# EAGLE design Gameboy Pocket (EAGLE 8.0.0)
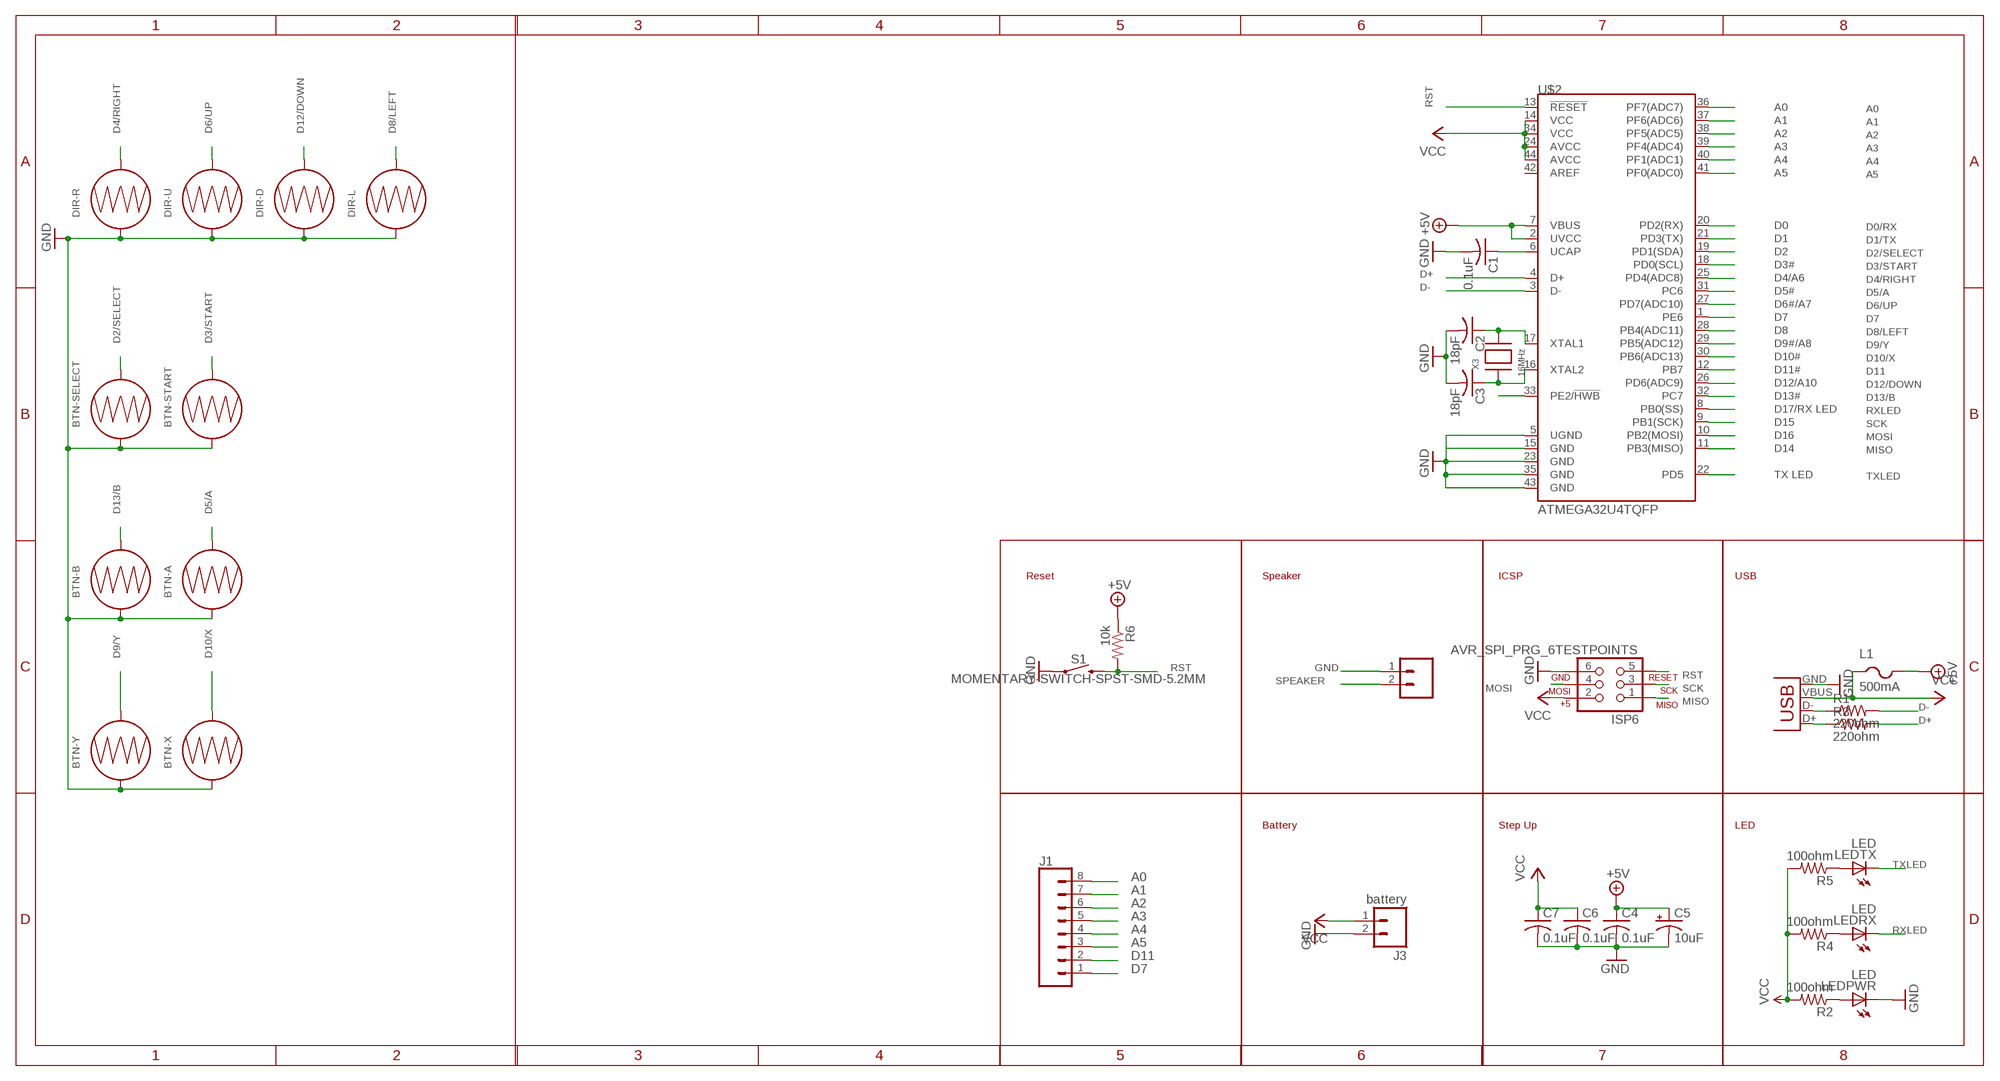
[diagram p0: schematic, sheet 1]

## Parts
BTN-A  BUTTON-CONDUCTIVESMD  [BUTTON-CONDUCTIVE]
BTN-B  BUTTON-CONDUCTIVESMD  [BUTTON-CONDUCTIVE]
BTN-SELECT  BUTTON-CONDUCTIVESMD  [BUTTON-CONDUCTIVE]
BTN-START  BUTTON-CONDUCTIVESMD  [BUTTON-CONDUCTIVE]
BTN-X  BUTTON-CONDUCTIVESMD  [BUTTON-CONDUCTIVE]
BTN-Y  BUTTON-CONDUCTIVESMD  [BUTTON-CONDUCTIVE]
C1  0.1uF  C-USC0805  [C0805]
C2  18pF  C-USC0805  [C0805]
C3  18pF  C-USC0805  [C0805]
C4  0.1uF  C-USC0805  [C0805]
C5  10uF  10UF-TANT  [EIA3216]
C6  0.1uF  C-USC0805  [C0805]
C7  0.1uF  C-USC0805  [C0805]
CN1  USB-SMD-NS  [USB-MINIB-NOSTOP]
DIR-D  BUTTON-CONDUCTIVESMD  [BUTTON-CONDUCTIVE]
DIR-L  BUTTON-CONDUCTIVESMD  [BUTTON-CONDUCTIVE]
DIR-R  BUTTON-CONDUCTIVESMD  [BUTTON-CONDUCTIVE]
DIR-U  BUTTON-CONDUCTIVESMD  [BUTTON-CONDUCTIVE]
ISP6  AVR_SPI_PRG_6TESTPOINTS  [2X3_TEST_POINTS]
J1  CONN_08NO_SILK_FEMALE_PTH  [1X08_NO_SILK]
J3  battery  M02JST-PTH-VERT  [JST-2-PTH-VERT]
JP2  M02PTH  [1X02]
L1  500mA  PTCFUSE-1206  [R1206]
LEDPWR  LED  LEDCHIPLED_0805  [CHIPLED_0805]
LEDRX  LED  LEDCHIPLED_0805  [CHIPLED_0805]
LEDTX  LED  LEDCHIPLED_0805  [CHIPLED_0805]
R1  220ohm  R-US_R0805  [R0805]
R2  100ohm  R-US_R0805  [R0805]
R3  220ohm  R-US_R0805  [R0805]
R4  100ohm  R-US_R0805  [R0805]
R5  100ohm  R-US_R0805  [R0805]
R6  10k  R-US_R0805  [R0805]
S1  MOMENTARY-SWITCH-SPST-SMD-5.2MM  [TACTILE_SWITCH_SMD_5.2MM]
U$2  ATMEGA32U4TQFP  [SPARKFUN-DIGITALIC_TQFP44]
X3  16MHz  XTALNX5032  [NX5032]

## Nets
+5V: C4.1 C5.A(+) L1.2 R6.1 U$2.2(UVCC) U$2.7(VBUS)
A0: J1.8 U$2.36(PF7(ADC7))
A1: J1.7 U$2.37(PF6(ADC6))
A2: J1.6 U$2.38(PF5(ADC5))
A3: J1.5 U$2.39(PF4(ADC4))
A4: J1.4 U$2.40(PF1(ADC1))
A5: J1.3 U$2.41(PF0(ADC0))
D0/RX: U$2.20(PD2(RX))
D1/TX: U$2.21(PD3(TX))
D2/SELECT: BTN-SELECT.2 U$2.19(PD1(SDA))
D3/START: BTN-START.2 U$2.18(PD0(SCL))
D4/RIGHT: DIR-R.2 U$2.25(PD4(ADC8))
D5/A: BTN-A.2 U$2.31(PC6)
D6/UP: DIR-U.2 U$2.27(PD7(ADC10))
D7: J1.1 U$2.1(PE6)
D8/LEFT: DIR-L.2 U$2.28(PB4(ADC11))
D9/Y: BTN-Y.2 U$2.29(PB5(ADC12))
D10/X: BTN-X.2 U$2.30(PB6(ADC13))
D11: J1.2 U$2.12(PB7)
D12/DOWN: DIR-D.2 U$2.26(PD6(ADC9))
D13/B: BTN-B.2 U$2.32(PC7)
D+: R3.2 U$2.4(D+)
D-: R1.2 U$2.3(D-)
GND: BTN-A.1 BTN-B.1 BTN-SELECT.1 BTN-START.1 BTN-X.1 BTN-Y.1 C1.2 C2.2 C3.2 C4.2 C5.C(-) C6.2 C7.2 CN1.GND DIR-D.1 DIR-L.1 DIR-R.1 DIR-U.1 ISP6.6 J3.2 JP2.1 LEDPWR.C S1.1 U$2.5(UGND) U$2.15(GND) U$2.23(GND) U$2.35(GND) U$2.43(GND)
HWB: U$2.33(PE2/!HWB)
MISO: ISP6.1 U$2.11(PB3(MISO))
MOSI: ISP6.4 U$2.10(PB2(MOSI))
N$2: LEDPWR.A R2.1
N$3: CN1.D+ R3.1
N$5: CN1.D- R1.1
N$6: LEDRX.A R4.1
N$7: LEDTX.A R5.1
N$8: C2.1 U$2.17(XTAL1) X3.P$2
N$9: C3.1 U$2.16(XTAL2) X3.P$1
RST: ISP6.5 R6.2 S1.3 U$2.13(!RESET)
RXLED: LEDRX.C U$2.8(PB0(SS))
SCK: ISP6.3 U$2.9(PB1(SCK))
SPEAKER: JP2.2
TXLED: LEDTX.C U$2.22(PD5)
UCAP: C1.1 U$2.6(UCAP)
VCC: C6.1 C7.1 CN1.VBUS ISP6.2 J3.1 L1.1 R2.2 R4.2 R5.2 U$2.14(VCC) U$2.24(AVCC) U$2.34(VCC) U$2.44(AVCC)
Unconnected: U$2.42(AREF)

## Notes on the sheet
- Reset | Speaker | ICSP | USB
- Battery | Step Up | LED

## Library data of the parts
BTN-A BTN-B BTN-SELECT BTN-START BTN-X BTN-Y DIR-D DIR-L DIR-R DIR-U = SparkFun-Electromechanical:BUTTON-CONDUCTIVE: Used with rubber key pads. This one was designed and proven to work with the PolyCase Key FOB enclosures.
C1-C4 C6 C7 = adafruit:C-US: CAPACITOR, American symbol
C5 = SparkFun-Retired:10UF-TANT: 10uF Tantalum SMT CAP-00811- 16V 10% (EIA-3216); PROD_ID: CAP-00811
CN1 = SparkFun-Connectors:USB: USB Connectors USB-B-PTH is fully proven SKU : PRT-00139/CONN-08278 USB-miniB is fully proven SKU : PRT-00587 USB-A-PCB is untested. USB-A-H is throughly reviewed, but untested. Spark Fun Electronics SKU : PRT-00437 USB-B-SMT is throughly reviewed, but untested. Needs silkscreen touching up. USB-A-S has not been used/tested USB-MB-H has not been used/tested USB-MICROB has been used. CONN-09505
ISP6 = SparkFun-Connectors:AVR_SPI_PRG_6: AVR ISP 6 Pin This is the reduced ISP connector for AVR programming. Common on Arduino. This footprint will take up less PCB space and can be used with a 10-pin to 6-pin adapter such as SKU: BOB-08508 **Special note about "TEST_POINT" package. The stop mask is on the top side, so if you want your programming test points to be on the bottom of your board, make sure to place this package on the bottom side of the board. This also ensure that the orientation to program from the bottom side will be correct.
J1 = SparkFun-Connectors:CONN_08: Multi connection point. Often used as Generic Header-pin footprint for 0.1 inch spaced/style header connections On any of the 0.1 inch spaced packages, you can populate with these: Break Away Headers - Straight <https://www.sparkfun.com/products/116> (PRT-00116) Break Away Male Headers - Right Angle <https://www.sparkfun.com/products/553> (PRT-00553) Female Headers <https://www.sparkfun.com/products/115> (PRT-00115) Break Away Headers - Machine Pin <https://www.sparkfun.com/products/117> (PRT-00117) Break Away Female Headers - Swiss Machine Pin <https://www.sparkfun.com/products/743> (PRT-00743) Arduino Stackable Header - 8 Pin <https://www.sparkfun.com/products/9279> (PRT-09279) For SCREWTERMINALS and SPRING TERMINALS visit here: Screw Terimnals on SparkFun.com <https://www.sparkfun.com/search/results?term=Screw+Terminals> (5mm/3.5mm/2.54mm spacing) This device is also useful as a general connection point to wire up your design to another part of your project. Our various solder wires solder well into these plated through hole pads. Hook-Up Wire - Assortment (Stranded, 22 AWG) <https://www.sparkfun.com/products/11375> (PRT-11375) Hook-Up Wire - Assortment (Solid Core, 22 AWG) <https://www.sparkfun.com/products/11367> (PRT-11367) View the entire wire category on our website here <https://www.sparkfun.com/categories/141> Special notes: Molex polarized connector foot print use with SKU : PRT-08231 with associated crimp pins and housings. 1MM SMD Version SKU: PRT-10208 NOTES ON THE VARIANTS LOCK and LOCK_LONGPADS... This footprint was designed to help hold the alignment of a through-hole component (i.e. 6-pin header) while soldering it into place. You may notice that each hole has been shifted either up or down by 0.005 of an inch from it's more standard position (which is a perfectly straight line). This slight alteration caused the pins (the squares in the middle) to touch the edges of the holes. Because they are alternating, it causes a "brace" to hold the component in place. 0.005 has proven to be the perfect amount of "off-center" position when using our standard breakaway headers. Although looks a little odd when you look at the bare footprint, once you have a header in there, the alteration is very hard to notice. Also,if you push a header all the way into place, it is covered up entirely on the bottom side.; PROD_ID: CONN-08438
J3 JP2 = SparkFun-Connectors:M02: Standard 2-pin 0.1" header. Use with - straight break away headers ( PRT-00116) - right angle break away headers (PRT-00553) - swiss pins (PRT-00743) - machine pins (PRT-00117) - female headers (PRT-00115) Molex polarized connector foot print use with: PRT-08233 with associated crimp pins and housings. 2.54_SCREWTERM for use with PRT-10571. 3.5mm Screw Terminal footprints for PRT-08084 5mm Screw Terminal footprints for use with PRT-08432
L1 = adafruit:PTCFUSE: PTC fuses, resettable thermistors
LEDPWR LEDRX LEDTX = adafruit:LED: LED OSRAM: - CHIPLED LG R971, LG N971, LY N971, LG Q971, LY Q971, LO R971, LY R971 LH N974, LH R974 LS Q976, LO Q976, LY Q976 LO Q996 - Hyper CHIPLED LW Q18S LB Q993, LB Q99A, LB R99A - SideLED LS A670, LO A670, LY A670, LG A670, LP A670 LB A673, LV A673, LT A673, LW A673 LH A674 LY A675 LS A676, LA A676, LO A676, LY A676, LW A676 LS A679, LY A679, LG A679 - Hyper Micro SIDELED® LS Y876, LA Y876, LO Y876, LY Y876 LT Y87S - SmartLED LW L88C, LW L88S LB L89C, LB L89S, LG L890 LS L89K, LO L89K, LY L89K LS L896, LA L896, LO L896, LY L896 - TOPLED LS T670, LO T670, LY T670, LG T670, LP T670 LSG T670, LSP T670, LSY T670, LOP T670, LYG T670 LG T671, LOG T671, LSG T671 LB T673, LV T673, LT T673, LW T673 LH T674 LS T676, LA T676, LO T676, LY T676, LB T676, LH T676, LSB T676, LW T676 LB T67C, LV T67C, LT T67C, LS T67K, LO T67K, LY T67K, LW E67C LS E67B, LA E67B, LO E67B, LY E67B, LB E67C, LV E67C, LT E67C LW T67C LS T679, LY T679, LG T679 LS T770, LO T770, LY T770, LG T770, LP T770 LB T773, LV T773, LT T773, LW T773 LH T774 LS E675, LA E675, LY E675, LS T675 LS T776, LA T776, LO T776, LY T776, LB T776 LHGB T686 LT T68C, LB T68C - Hyper Mini TOPLED® LB M676 - Mini TOPLED Santana® LG M470 LS M47K, LO M47K, LY M47K Source: http://www.osram.convergy.de/
R1-R6 = adafruit:R-US_: RESISTOR, American symbol
S1 = SparkFun-Switches:MOMENTARY-SWITCH-SPST: Momentary Switch (Pushbutton) - SPST Normally-open (NO) SPST momentary switches (buttons, pushbuttons). Variants PTH-12MM - 12mm square, through-hole Momentary Pushbutton Switch - 12mm Square <https://www.sparkfun.com/products/9190> (COM-09190) PTH-6.0MM, PTH-6.0MM-KIT - 6.0mm square, through-hole Mini Pushbutton Switch <https://www.sparkfun.com/products/97> (COM-00097) KIT package intended for soldering kit's - only one side of pads' copper is exposed. PTH-RIGHT-ANGLE-KIT - Right-angle, through-hole Right Angle Tactile Button <https://www.sparkfun.com/products/10791> - Used on SparkFun BigTime Watch Kit <https://www.sparkfun.com/products/11734> SMD-12MM - 12mm square, surface-mount Tactile Button - SMD (12mm) <https://www.sparkfun.com/products/12993> (COM-12993) Used on SparkFun PicoBoard <https://www.sparkfun.com/products/11888> SMD-4.5MM - 4.5mm Square Trackball Switch Used on SparkFun Blackberry Trackballer Breakout <https://www.sparkfun.com/products/13169> SMD-4.6MMX2.8MM - 4.60mm x 2.80mm, surface mount Used on SparkFun SAMD21 Mini Breakout <https://www.sparkfun.com/products/13664> SMD-5.2MM, SMD-5.2-REDUNDANT - 5.2mm square, surface-mount Mini Pushbutton Switch - SMD <https://www.sparkfun.com/products/8720> (COM-08720) Used on Arduino Pro Mini <https://www.sparkfun.com/products/11114> REDUNDANT package connects both switch circuits together SMD-6.0X3.5MM - 6.0 x 3.5mm, surface mount Momentary Reset Switch SMD <https://www.sparkfun.com/products/8229> (COM-08229) SMD-6.2MM-TALL - 6.2mm square, surface mount Tactile Button - SMD (6mm) <https://www.sparkfun.com/products/12992> Used on SparkFun Digital Sandbox <https://www.sparkfun.com/products/12651> SMD-RIGHT-ANGLE - Right-angle, surface mount Used on SparkFun Block for Intel® Edison - Arduino <https://www.sparkfun.com/products/13036>; PROD_ID: SWCH-08247; SF_SKU: COM-08720
U$2 = SparkFun-Retired:ATMEGA32U4: Atmel 44-pin 8-bit Microcontroller with 32KBytes of ISP Flash and USB Controller ----- Please use the QFN-44-NOPAD_1:1 package for the footprint of all boards using a 32U4. Route traces directly away from the pads as much as possible.; PROD_ID: IC-11161
X3 = adaprog:XTAL

## Board
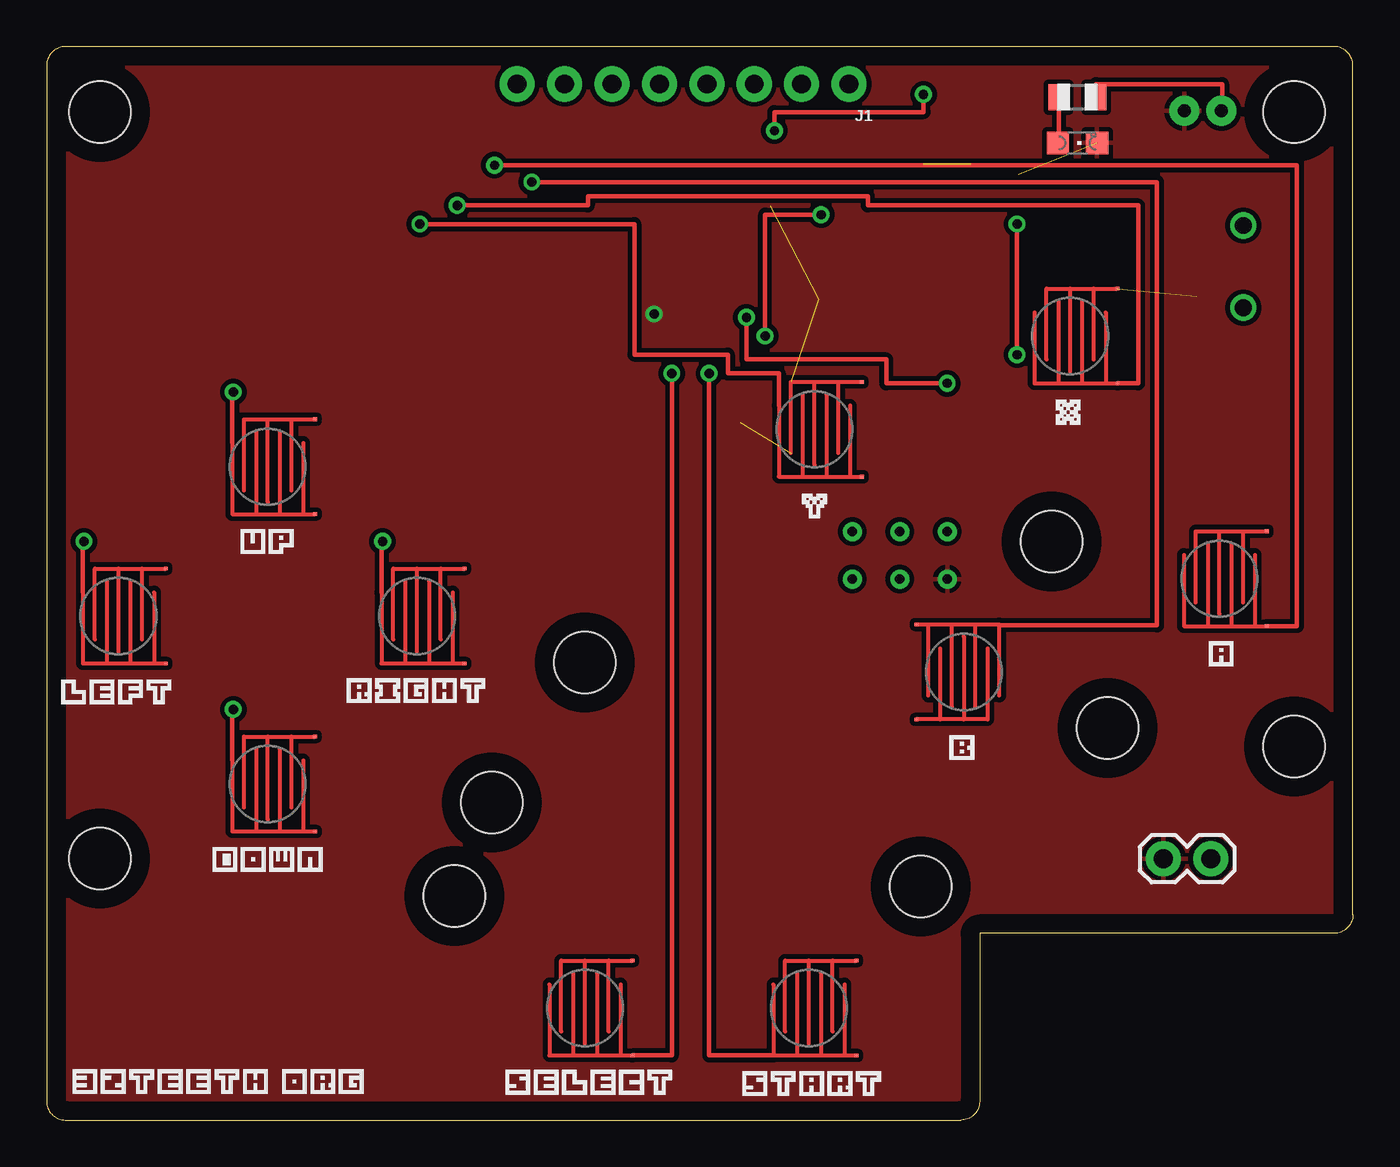
[diagram p1: board, top side]
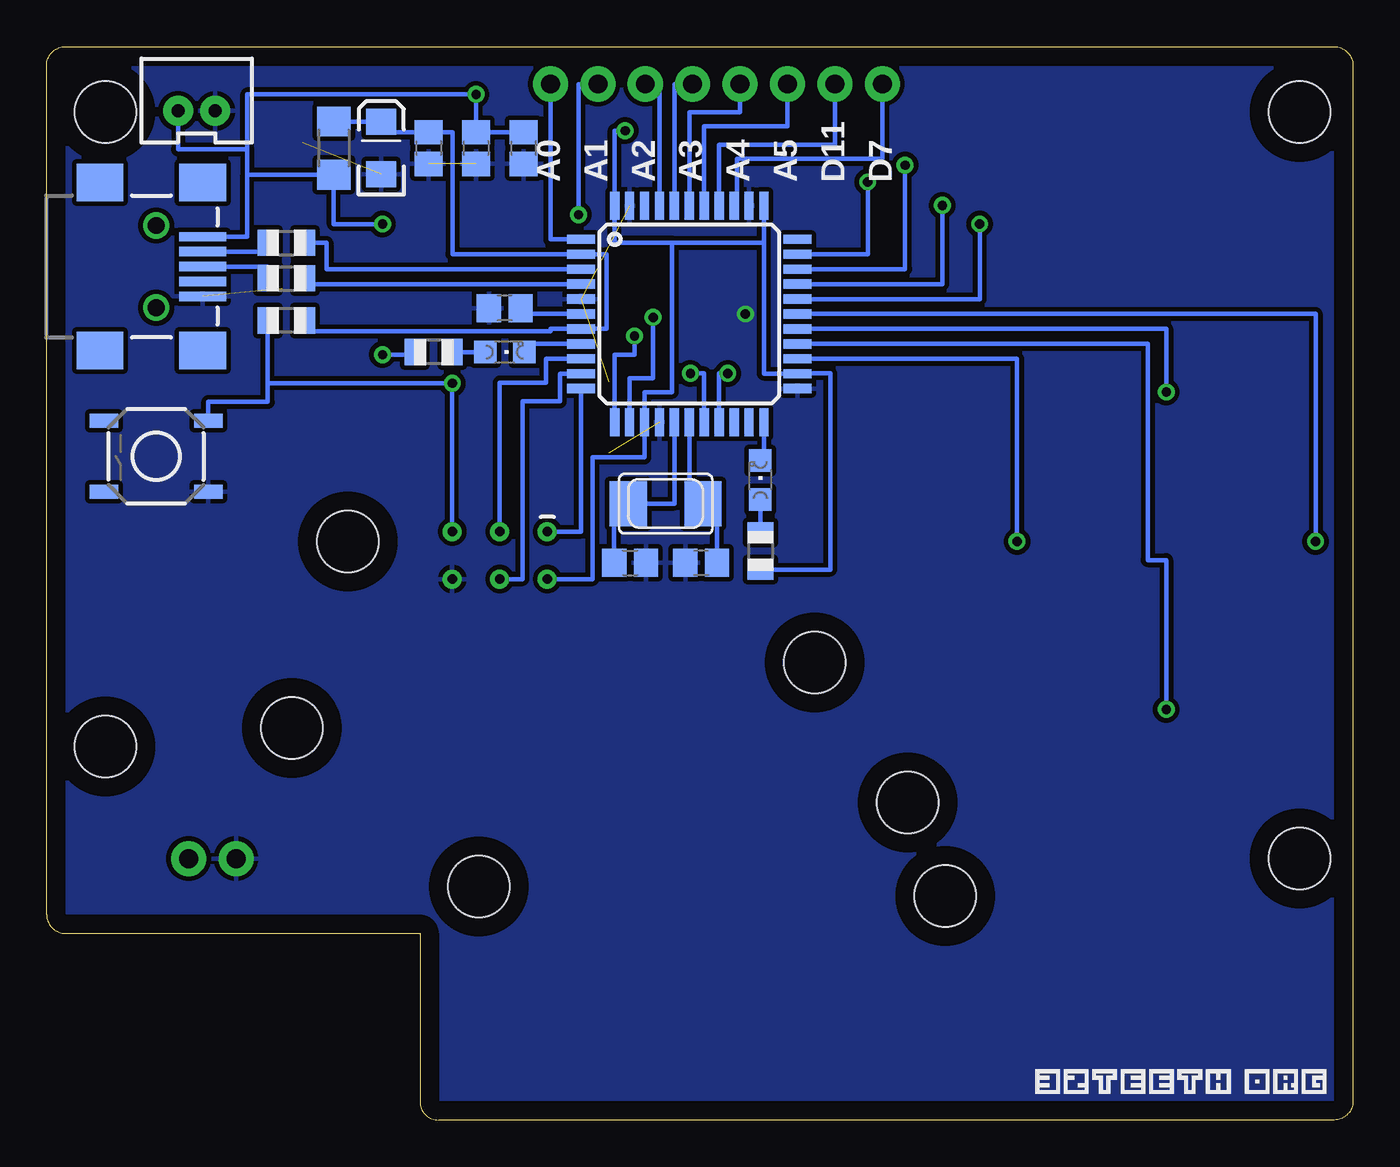
[diagram p2: board, bottom side, seen from below]

Size 70 x 57.5 mm. Coordinates in mm from the lower left corner, seen from the top.
Outline: 70,11 70,56.5 arc90 69,57.5 1,57.5 arc90 0,56.5 0,1 arc90 1,0 49,0 arc90 50,1 50,10 69,10 arc90 70,11
Copper layers (1*16): Top 0.035mm / dielectric 1.5mm / Bottom 0.035mm
Design rules "default *": minimum track width 10mil, minimum drill 20mil, track to track 10mil, track to pad 10mil, pad to pad 10mil, via to via 10mil, smd to smd 10mil, copper to edge 40mil, drill to drill 20mil, minimum pad ring 10mil, minimum via ring 8mil, stop-mask expansion 4mil, vias tented up to drill 20mil, thermal gap 10mil

### Footprints (pad centres in the part's own frame; a part is rotated, then mirrored left to right if it is on the bottom)
BUTTON-CONDUCTIVE = smd 0.203 x 0.203: 1 2.54,2.54; 2 2.54,-2.54
C0805 = smd 1.3 x 1.5: 1 -0.85,0; 2 0.85,0
EIA3216 = smd 1.4 x 1.6: A 1.4,0; C -1.4,0
USB-MINIB-NOSTOP = smd 2.5 x 0.5: D+ 2.5,0; D- 2.5,0.8; GND 2.5,-1.6; ID 2.5,-0.8; VBUS 2.5,1.6 | smd 2.5 x 2: G1 -3,-4.5; G2 -3,4.5; G3 2.5,4.5; G4 2.5,-4.5 | drill 0.9 pad 0.8: H1 0,2.2 | drill 0.9 pad 0.787: H2 0,-2.2
2X3_TEST_POINTS = drill 0.508: 1 -2.54,-1.27; 2 -2.54,1.27; 3 0,-1.27; 4 0,1.27; 5 2.54,-1.27; 6 2.54,1.27
1X08_NO_SILK = drill 1.016 pad 1.88: 1 0,0; 2 2.54,0; 3 5.08,0; 4 7.62,0; 5 10.16,0; 6 12.7,0; 7 15.24,0; 8 17.78,0
JST-2-PTH-VERT = drill 0.7 pad 1.6: 1 -1,-0.55; 2 1,-0.55
1X02 = drill 1.016 pad 1.88: 1 0,0; 2 2.54,0
R1206 = smd 1.6 x 1.803: 1 -1.422,0; 2 1.422,0
CHIPLED_0805 = smd 1.2 x 1.2: A 0,-1.05; C 0,1.05
R0805 = smd 1.1 x 1.4: 1 -1,0; 2 1,0
TACTILE_SWITCH_SMD_5.2MM = smd 1.524 x 0.762: 1 -2.794,1.905; 2 2.794,1.905; 3 -2.794,-1.905; 4 2.794,-1.905
SPARKFUN-DIGITALIC_TQFP44 = smd 1.5 x 0.5: 1 -5.8,4; 2 -5.8,3.2; 3 -5.8,2.4; 4 -5.8,1.6; 5 -5.8,0.8; 6 -5.8,0; 7 -5.8,-0.8; 8 -5.8,-1.6; 9 -5.8,-2.4; 10 -5.8,-3.2; 11 -5.8,-4; 23 5.8,-4; 24 5.8,-3.2; 25 5.8,-2.4; 26 5.8,-1.6; 27 5.8,-0.8; 28 5.8,0; 29 5.8,0.8; 30 5.8,1.6; 31 5.8,2.4; 32 5.8,3.2; 33 5.8,4 | smd 0.5 x 1.5: 12 -4,-5.8; 13 -3.2,-5.8; 14 -2.4,-5.8; 15 -1.6,-5.8; 16 -0.8,-5.8; 17 0,-5.8; 18 0.8,-5.8; 19 1.6,-5.8; 20 2.4,-5.8; 21 3.2,-5.8; 22 4,-5.8; 34 4,5.8; 35 3.2,5.8; 36 2.4,5.8; 37 1.6,5.8; 38 0.8,5.8; 39 0,5.8; 40 -0.8,5.8; 41 -1.6,5.8; 42 -2.4,5.8; 43 -3.2,5.8; 44 -4,5.8
STAND-OFF = hole 3.302: 0,0
NX5032 = smd 2 x 2.4: P$1 2,0; P$2 -2,0

### Placement (x,y rotation side)
BTN-A  62.85,29 0 top
BTN-B  49.15,24 180 top
BTN-SELECT  28.85,6 0 top
BTN-START  40.85,6 0 top
BTN-X  54.85,42 0 top
BTN-Y  41.15,37 0 top
C1  45.45,43.5 180 bottom
C2  34.92,29.84 180 bottom
C3  38.73,29.84 0 bottom
C4  49.53,52.07 270 bottom
C5  52.07,52.07 90 bottom
C6  46.99,52.07 270 bottom
C7  44.45,52.07 270 bottom
CN1  64.14,45.72 0 bottom
DIR-D  11.85,18 0 top
DIR-L  3.85,27 0 top
DIR-R  19.85,27 0 top
DIR-U  11.85,35 0 top
ISP6  45.72,30.25 180 bottom
J1  43,55.5 180 top
J3  61.96,54.61 0 bottom
JP2  59.85,14 0 top
L1  54.61,52.07 90 bottom
LEDPWR  55.24,52.34 270 top
LEDRX  45.45,41.14 270 bottom
LEDTX  31.75,34.29 0 bottom
R1  57.15,46.99 0 bottom
R2  55.24,54.8 0 top
R3  57.15,45.09 0 bottom
R4  49.26,41.14 180 bottom
R5  31.75,30.48 270 bottom
R6  57.15,42.83 180 bottom
S1  64.14,35.56 180 bottom
U$2  35.56,43.18 0 bottom
U$3  [STAND-OFF]  2.85,14 90 top
U$4  [STAND-OFF]  46.85,12.5 90 top
U$5  [STAND-OFF]  66.85,20 90 top
U$6  [STAND-OFF]  28.85,24.5 90 top
U$7  [STAND-OFF]  23.85,17 90 top
U$8  [STAND-OFF]  2.85,54 90 top
U$9  [STAND-OFF]  56.85,21 90 top
U$10  [STAND-OFF]  21.85,12 90 top
U$11  [STAND-OFF]  53.85,31 90 top
U$12  [STAND-OFF]  66.85,54 90 top
X3  36.83,33.02 180 bottom

### Tracks (layer width: path | path; a pad name or v marks a point on that pad's centre or on a via)
+5V
  Bottom 0.254: L1.2 54.61,53.47 C5.A 52.07,52.92 C4.1 48.25,52.92 48.25,46.38 U$2.2 40,46.38 40,42.38 U$2.7 43,42.38 43,42.25 56.15,42.25 R6.1
A0
  Bottom 0.254: U$2.36 33,48.98 33,51.5 25.22,51.5 J1.8
A1
  Bottom 0.254: J1.7 27.76,52.25 33.96,52.25 U$2.37
A2
  Bottom 0.254: U$2.38 34.76,53.25 30.3,53.25 J1.6
A3
  Bottom 0.254: U$2.39 35.56,54 32.84,54 J1.5
A4
  Bottom 0.254: U$2.40 36.36,55.5 J1.4
A5
  Bottom 0.254: U$2.41 37.16,55.5 J1.3
D2/SELECT  (via drill 0.5)
  Top 0.254: v33.5,40 33.5,3.46 BTN-SELECT.2
  Bottom 0.254: U$2.19 33.96,40 v33.5,40
D3/START  (via drill 0.5)
  Top 0.254: v35.5,40 35.5,3.46 38.95,3.46
  Bottom 0.254: U$2.18 34.76,40 v35.5,40
D4/RIGHT  (via drill 0.5)
  Top 0.254: v18,31 17.95,31 17.95,28.27
  Bottom 0.254: U$2.25 18,40.78 v18,31
D5/A  (via drill 0.5)
  Top 0.254: v24,51.15 67,51.15 67,26.46 BTN-A.2
  Bottom 0.254: U$2.31 24,45.58 v24,51.15
D6/UP  (via drill 0.5)
  Top 0.254: v10,39 9.95,39 9.95,36.27
  Bottom 0.254: U$2.27 10,42.38 v10,39
D7
  Bottom 0.254: U$2.1 43,47.18 J1.1
D8/LEFT  (via drill 0.5)
  Top 0.254: v2,31 1.95,31 1.95,28.27
  Bottom 0.254: U$2.28 2,43.18 v2,31
D9/Y  (via drill 0.5)
  Top 0.254: v20,48 31.5,48 31.5,41 36.5,41 36.5,40 39.24,40 39.24,38.27
  Bottom 0.254: U$2.29 20,43.98 v20,48
D10/X  (via drill 0.5)
  Top 0.254: BTN-X.2 58.5,39.46 58.5,49 44,49 44,49.5 29,49.5 29,49 v22,49
  Bottom 0.254: U$2.30 22,44.78 v22,49
D11  (via drill 0.5)
  Top 0.254: v38.5,42 38.5,48.5 v41.5,48.5
  Bottom 0.254: U$2.12 39.56,41 38.5,41 v38.5,42 | v41.5,48.5 41.5,55.5 J1.2
D12/DOWN  (via drill 0.5)
  Top 0.254: v10,22 9.95,22 9.95,19.27
  Bottom 0.254: U$2.26 11,41.58 11,30 10,30 v10,22
D13/B  (via drill 0.5)
  Top 0.254: v26,50.25 59.5,50.25 59.5,26.5 51.05,26.5 51.05,26.54
  Bottom 0.254: U$2.32 26,46.38 v26,50.25
D+
  Bottom 0.254: R3.2 56.15,44.78 U$2.4
D-
  Bottom 0.254: R1.2 55,46.99 55,45.58 U$2.3
GND  (via drill 0.5)  (6 unrouted)
  other vias: 32.56,43.18
  pour Bottom: 0,57.5 70,57.5 70,10 50,10 50,0 0,0
  pour Top: 0,0 0,57.5 70,57.5 70,10 50,10 50,0
MISO
  Bottom 0.254: ISP6.1 41.36,31.52 U$2.11
MOSI
  Bottom 0.254: U$2.10 42.5,39.98 42.5,38.5 44.5,38.5 44.5,28.98 ISP6.4
N$2
  Top 0.254: R2.1 54.24,52.34 LEDPWR.A
N$3
  Bottom 0.254: CN1.D+ 58.15,45.72 R3.1
N$5
  Bottom 0.254: CN1.D- 58.15,46.52 R1.1
N$6
  Bottom 0.254: LEDRX.A R4.1
N$7
  Bottom 0.254: R5.1 LEDTX.A
N$8
  Bottom 0.254: U$2.17 35.56,33.02 X3.P$2 34.08,33.02 C2.1
N$9
  Bottom 0.254: U$2.16 36.36,33.02 X3.P$1 39.59,33.02 C3.1
RST  (via drill 0.5)
  Top 0.254: v48.26,39.47 45,39.47 45,40.75 37.5,40.75 v37.5,43
  Bottom 0.254: 58.15,39.47 R6.2 | ISP6.5 v48.26,39.47 58.15,39.47 | S1.3 61.34,38.47 58.15,38.47 58.15,39.47 | U$2.13 38.76,39.75 37.5,39.75 v37.5,43
RXLED
  Bottom 0.254: U$2.8 44.4,41.58 LEDRX.C
SCK
  Bottom 0.254: U$2.9 43.25,40.78 43.25,39.5 45.72,39.5 ISP6.3
TXLED
  Bottom 0.254: U$2.22 31.56,35.34 LEDTX.C
UCAP
  Bottom 0.254: U$2.6 44.6,43.18 C1.1
VCC  (via drill 0.5)
  Top 0.254: 56.24,54.94 R2.2 56.24,55.5 63,55.5 63,54.06 J3.1 | v52,41 v52,48 | v39,53 39,54 46.99,54 v46.99,54.94
  Bottom 0.254: C7.1 C6.1 v46.99,54.94 59.25,54.94 59.25,52 | CN1.VBUS 59.25,47.32 59.25,50.65 | 59.25,50.65 L1.1 54.61,48 v52,48 | 59.25,52 59.25,50.65 | ISP6.2 40.75,28.98 40.75,35.5 37.96,35.5 U$2.14 37.96,39 36.5,39 36.5,47 | 36.5,47 31.56,47 | 36.5,47 39.56,47 U$2.44 39.56,53 v39,53 | 31.56,47 U$2.34 | 31.56,47 31.56,39.98 U$2.24 29.76,40 28,40 28,29.48 R5.2 | R4.2 50.26,41 v52,41 | J3.1 62.96,52 59.25,52

### Text on the board
bPlace: A0 / A1 / A2 / A3 / A4 / A5 / D11 / D7